# EasyEDA Pro project ProPrj_Lan_Relay_blog_2026-03-05_10-33-51_2026-03-13.epro, schematic Schematic1
Board Name: Board1; Create Date: 2026-03-05; Page Name: P1; Project Name: Lan_Relay_blog_2026-03-05_10-33-51; Schematic Name: Schematic1; Update Date: 2026-03-05; Company: EasyEDA.com; Page Size: A4; Version: V1.0
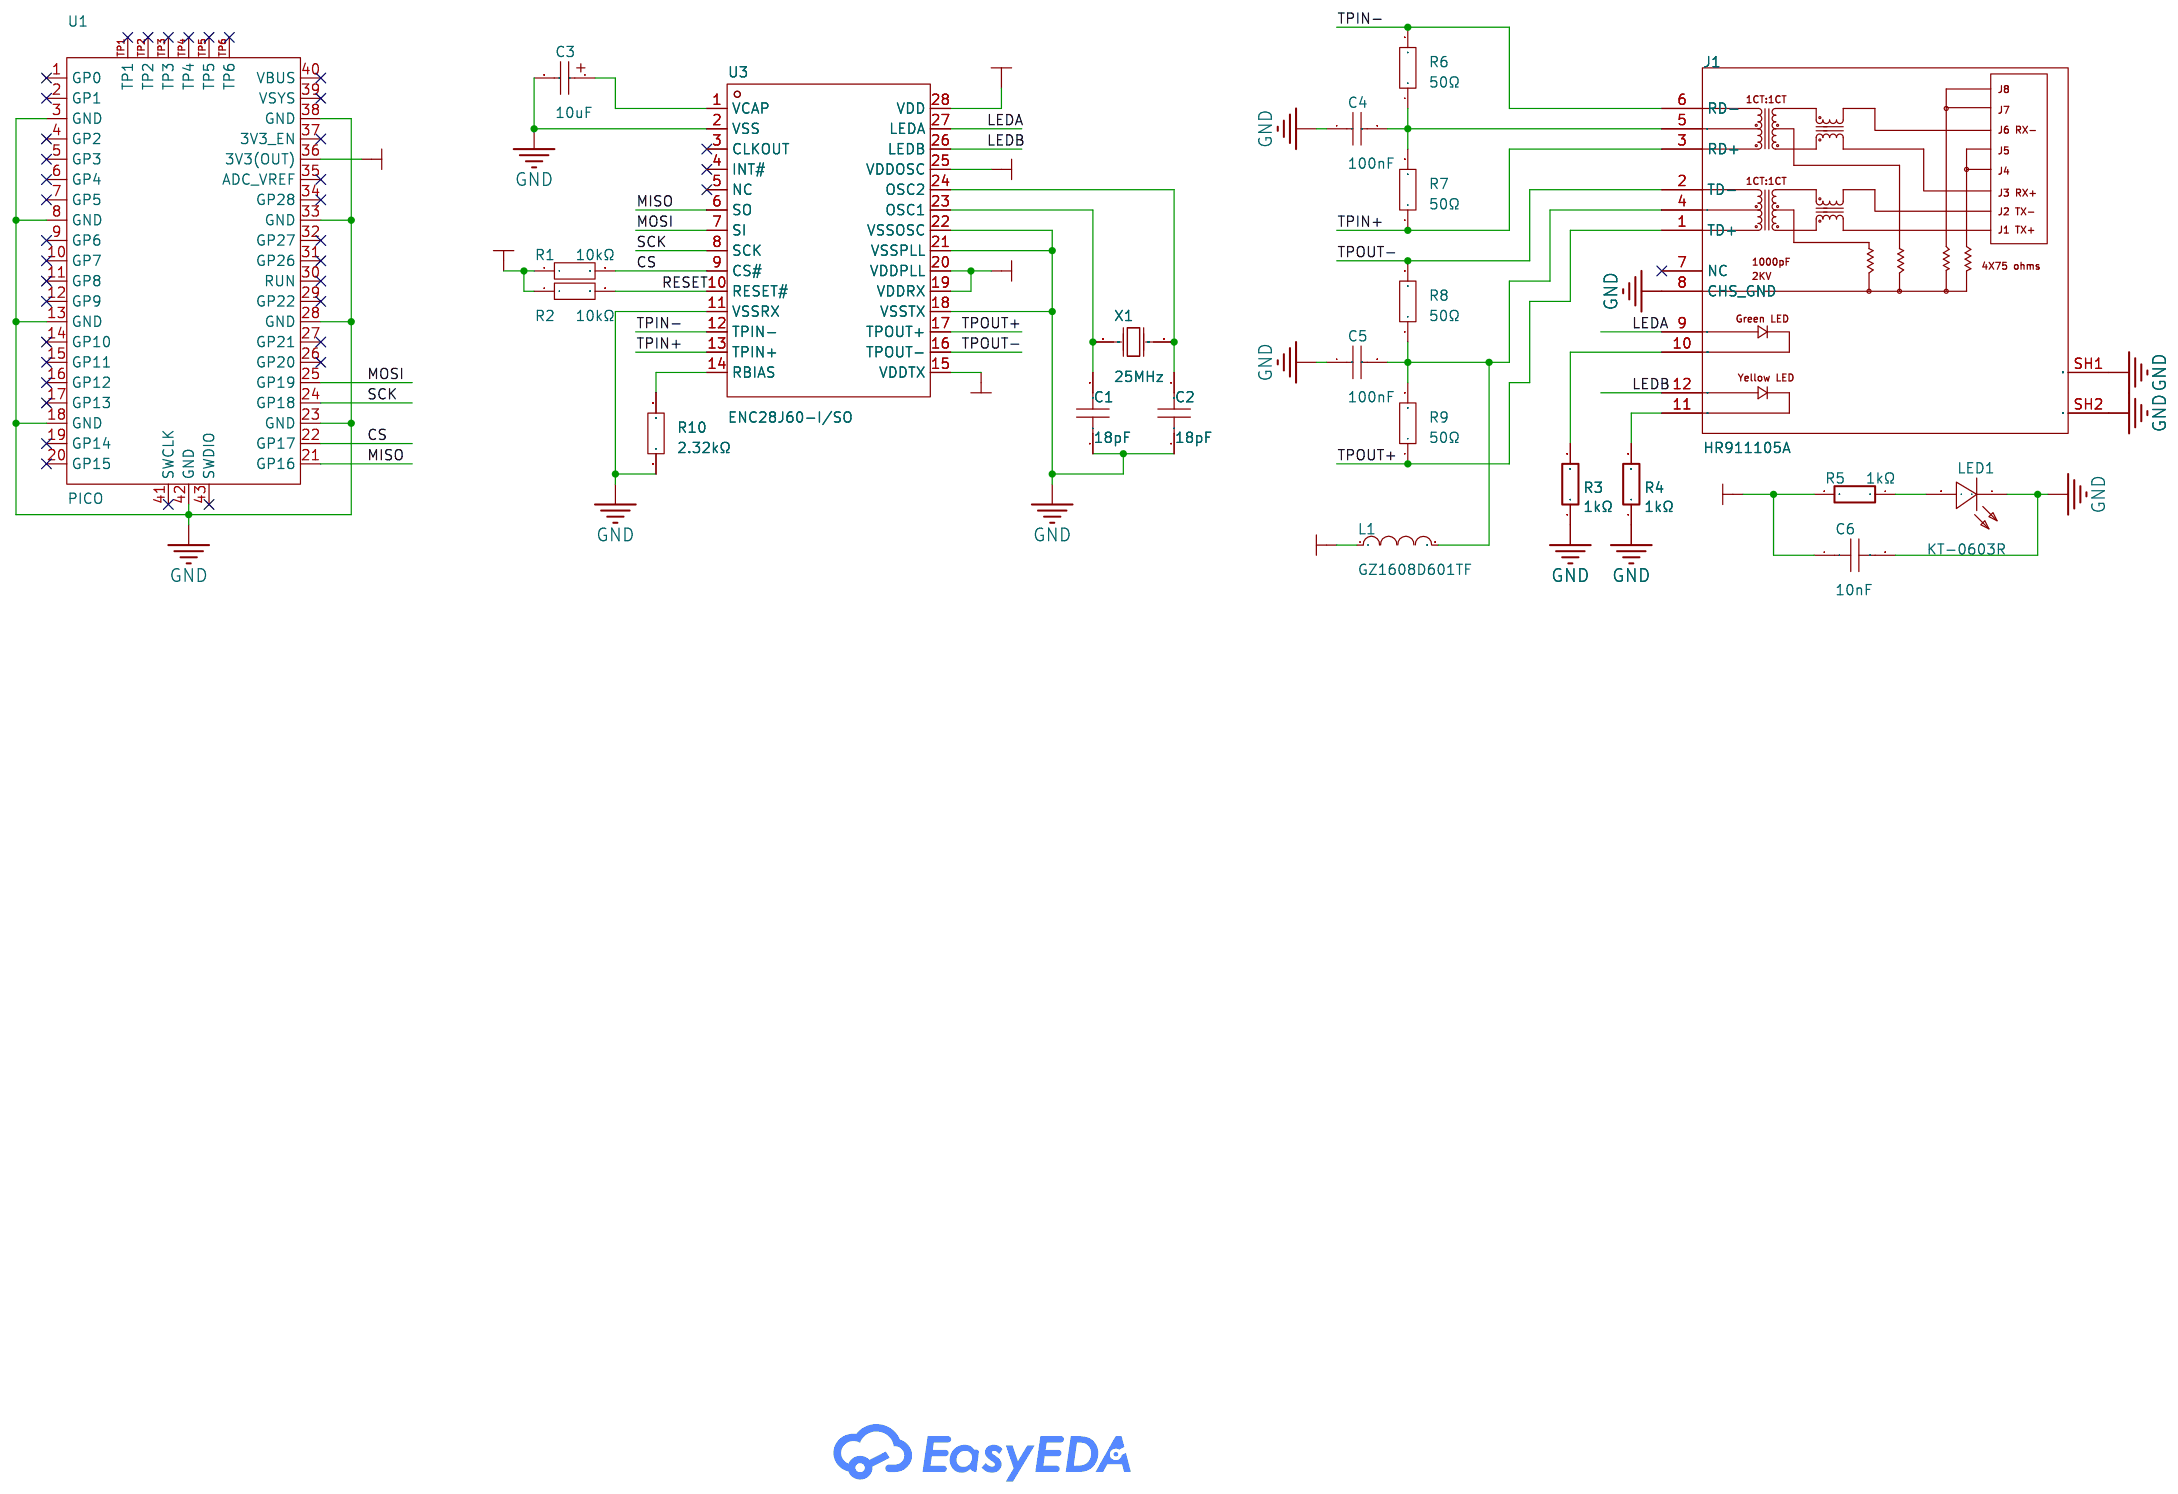
[diagram p0: schematic sheet]

## Parts
C1  18pF  [C0603]
C2  18pF  [C0603]
C3  10uF  [CAP-SMD_L3.2-W1.6-RD-C7171]
C4  100nF  [C0805]
C5  100nF  [C0805]
C6  10nF  [C0603]
J1  HR911105A  [RJ45-TH_HR911105A]
L1  GZ1608D601TF  [L0603]
LED1  KT-0603R  [LED0603-RD]
R1  10kΩ  [R0603]
R2  10kΩ  [R0603]
R3  1kΩ  [R0603]
R4  1kΩ  [R0603]
R5  1kΩ  [R0603]
R6  50Ω  [R0603]
R7  50Ω  [R0603]
R8  50Ω  [R0603]
R9  50Ω  [R0603]
R10  2.32kΩ  [R0603]
U1  PICO  [COMM-SMD_L51.0-W21.0-P2.54_SC0916]
U3  ENC28J60-I/SO  [SOIC-28_L17.9-W7.5-P1.27-LS10.3-BL]
X1  25MHz  [HC-49US_L11.5-W4.5-P4.88]

## Library data of the parts
C1 C2 = CL10C180JB8NNNC: Capacitance:18pF Tolerance:±5% Tolerance:±5% Voltage Rating:50V Temperature Coefficient:C0G; LCSC Part Name: 18pF ±5% 50V; Supplier Part: C1647; Manufacturer: SAMSUNG(三星); Supplier Footprint: 0603; JLCPCB Part Class: Basic Part; Datasheet: https://item.szlcsc.com/datasheet/CL10C180JB8NNNC/1999.html; Supplier: LCSC; Tolerance: ±5%; Voltage Rating: 50V; Temperature Coefficient: C0G
C3 = TAJA106K016RNJ: Capacitance:10uF Tolerance:±10% Tolerance:±10% Voltage Rating:16V Equivalent Series Resistance(ESR):3Ω@100kHz Operating Temperature:-55℃~+125℃ Operating Temperature:-55℃~+125℃; LCSC Part Name: 10uF ±10% 16V; Supplier Part: C7171; Manufacturer: Kyocera AVX; Supplier Footprint: CASE-A-3216-18(mm); JLCPCB Part Class: Basic Part; Supplier: LCSC; Tolerance: ±10%; Voltage Rating: 16V; Equivalent Series Resistance(ESR): 3Ω@100kHz; Operating Temperature: -55℃~+125℃
C4 C5 = CL21B104KCFNNNE: Capacitance:100nF Tolerance:±10% Tolerance:±10% Voltage Rating:100V Temperature Coefficient:X7R; LCSC Part Name: 100nF ±10% 100V; Supplier Part: C28233; Manufacturer: SAMSUNG(三星); Supplier Footprint: 0805; JLCPCB Part Class: Basic Part; Datasheet: https://item.szlcsc.com/datasheet/CL21B104KCFNNNE/28983.html; Supplier: LCSC; Tolerance: ±10%; Voltage Rating: 100V; Temperature Coefficient: X7R
C6 = 0603B103K500NT: Capacitance:10nF Tolerance:±10% Tolerance:±10% Voltage Rating:50V Temperature Coefficient:X7R; LCSC Part Name: 10nF ±10% 50V; Supplier Part: C57112; Manufacturer: FH(风华); Supplier Footprint: 0603; JLCPCB Part Class: Basic Part; Datasheet: https://item.szlcsc.com/datasheet/0603B103K500NT/58143.html; Supplier: LCSC; Tolerance: ±10%; Voltage Rating: 50V; Temperature Coefficient: X7R
J1 = HR911105A_C12074: Connector Type:RJ45 Jack Mounting Type:- Number of Ports:1 LED:With LED Shielding:- Ratings:- PoE:Non-PoE Supplementary Features:Filtered Contact Material:- Contact Plating:- Operating Temperature:- Operating Temperature:-; LCSC Part Name: 带LED; Supplier Part: C12074; Manufacturer: HANRUN(汉仁); Supplier Footprint: 插件; JLCPCB Part Class: Extended Part; Datasheet: https://item.szlcsc.com/datasheet/HR911105A/12651.html; Supplier: LCSC; Connector Type: RJ45 Jack; Number of Ports: 1; LED: With LED; PoE: Non-PoE; Supplementary Features: Filtered
L1 = GZ1608D601TF: Impedance @ Frequency:600Ω@100MHz Tolerance:±25% Tolerance:±25% DC Resistance(DCR):450mΩ Current Rating:200mA Number of Circuits:1 Operating Temperature:-55℃~+125℃ Operating Temperature:-55℃~+125℃; LCSC Part Name: 单路 0603磁珠 阻抗600Ω@100MHz; Supplier Part: C1002; Manufacturer: Sunlord(顺络); Supplier Footprint: 0603; JLCPCB Part Class: Basic Part; Datasheet: https://item.szlcsc.com/datasheet/GZ1608D601TF/1354.html; Supplier: LCSC; Impedance @ Frequency: 600Ω@100MHz; Tolerance: ±25%; DC Resistance(DCR): 450mΩ; Current Rating: 200mA; Number of Circuits: 1; Operating Temperature: -55℃~+125℃
LED1 = KT-0603R: Emitted Color:Red Power Dissipation:- Forward Current:- Dominant Wavelength:- Dominant Wavelength:- Peak Wavelength:- Diode Configuration:- Lens Color:- Color Temperature:- Color Temperature:- Viewing Angle:- Mounting Sytle:- Operating Temperature:-40℃~+8; LCSC Part Name: 0603 红灯 高亮; Supplier Part: C2286; Manufacturer: KENTO; Supplier Footprint: 0603; JLCPCB Part Class: Basic Part; Datasheet: https://atta.szlcsc.com/upload/public/pdf/source/20160616/1466072038404.pdf; Supplier: LCSC; Emitted Color: Red; Operating Temperature: -40℃~+85℃
R1 R2 = 0603WAF1002T5E: Type:Thick Film Resistor Resistance:10kΩ Tolerance:±1% Tolerance:±1% Power(Watts):100mW Voltage-Supply(Max):75V Temperature Coefficient:±100ppm/℃ Temperature Coefficient:±100ppm/℃ Operating Temperature:-55℃~+155℃ Operating Temperature:-55℃~+155℃; LCSC Part Name: 厚膜电阻 10kΩ ±1% 100mW; Supplier Part: C25804; Manufacturer: UNI-ROYAL(厚声); Supplier Footprint: 0603; JLCPCB Part Class: Basic Part; Datasheet: https://item.szlcsc.com/datasheet/0603WAF1002T5E/26547.html; Supplier: LCSC; Type: Thick Film Resistor; Tolerance: ±1%; Power(Watts): 100mW; Voltage-Supply(Max): 75V; Temperature Coefficient: ±100ppm/℃; Operating Temperature: -55℃~+155℃
R3-R5 = 0603WAF1001T5E: Type:Thick Film Resistor Resistance:1kΩ Tolerance:±1% Tolerance:±1% Power(Watts):100mW Voltage-Supply(Max):75V Temperature Coefficient:±100ppm/℃ Temperature Coefficient:±100ppm/℃ Operating Temperature:-55℃~+155℃ Operating Temperature:-55℃~+155℃; LCSC Part Name: 1kΩ ±1% 100mW 厚膜电阻; Supplier Part: C21190; Manufacturer: UNI-ROYAL(厚声); Supplier Footprint: 0603; JLCPCB Part Class: Basic Part; Datasheet: https://item.szlcsc.com/datasheet/0603WAF1001T5E/21904.html; Supplier: LCSC; Type: Thick Film Resistor; Tolerance: ±1%; Power(Watts): 100mW; Voltage-Supply(Max): 75V; Temperature Coefficient: ±100ppm/℃; Operating Temperature: -55℃~+155℃
R6-R9 = CRCW060350R0FKEA: Type:Thick Film Resistors Resistance:50Ω Tolerance:±1% Tolerance:±1% Power(Watts):100mW Temperature Coefficient:±100ppm/℃ Temperature Coefficient:±100ppm/℃ Operating Temperature:-55℃~+155℃ Operating Temperature:-55℃~+155℃; LCSC Part Name: 厚膜电阻 50Ω ±1% 100mW; Supplier Part: C844932; Manufacturer: VISHAY(威世); Supplier Footprint: 0603; JLCPCB Part Class: Extended Part; Datasheet: https://item.szlcsc.com/datasheet/CRCW060350R0FKEA/904506.html; Supplier: LCSC; Type: Thick Film Resistors; Tolerance: ±1%; Power(Watts): 100mW; Temperature Coefficient: ±100ppm/℃; Operating Temperature: -55℃~+155℃
R10 = 0603WAF2321T5E: Type:Thick Film Resistor Resistance:2.32kΩ Tolerance:±1% Tolerance:±1% Power(Watts):100mW Voltage-Supply(Max):75V Temperature Coefficient:±100ppm/℃ Temperature Coefficient:±100ppm/℃ Operating Temperature:-55℃~+155℃ Operating Temperature:-55℃~+155℃; LCSC Part Name: 2.32kΩ ±1% 100mW 厚膜电阻; Supplier Part: C22905; Manufacturer: UNI-ROYAL(厚声); Supplier Footprint: 0603; JLCPCB Part Class: Extended Part; Datasheet: https://item.szlcsc.com/datasheet/0603WAF2321T5E/23632.html; Supplier: LCSC; Type: Thick Film Resistor; Tolerance: ±1%; Power(Watts): 100mW; Voltage-Supply(Max): 75V; Temperature Coefficient: ±100ppm/℃; Operating Temperature: -55℃~+155℃
U1 = PICO: Supplier Part: C7203002; Manufacturer: Raspberry Pi(树莓派); JLCPCB Part Class: Extended Part; Datasheet: https://item.szlcsc.com/datasheet/PICO/8170960.html; Supplier: LCSC
U3 = ENC28J60-I/SO: Number of Channels:1 Interface:SPI Voltage - Supply:3.3V Voltage - Supply:3.3V Current - Supply:160mA Operating Temperature:-40℃~+85℃ Operating Temperature:-40℃~+85℃; Supplier Part: C47351; Manufacturer: MICROCHIP(美国微芯); Supplier Footprint: SOIC-28-300mil; JLCPCB Part Class: Extended Part; Datasheet: https://item.szlcsc.com/datasheet/ENC28J60-I%252FSO/48356.html; Supplier: LCSC; Number of Channels: 1; Interface: SPI; Voltage - Supply: 3.3V; Current - Supply: 160mA; Operating Temperature: -40℃~+85℃
X1 = X49SD25MSD2SC: Type:Through-Hole Crystal Oscillator Frequency:25MHz Normal temperature Frequency Tolerance:±20ppm Normal temperature Frequency Tolerance:±20ppm Load Capacitance:20pF Frequency Stability:±30ppm Frequency Stability:±30ppm Operating Temperature:-20℃~+70℃ Op; LCSC Part Name: HC-49US 25MHZ 2P 49S 20PF ±20PPM -20~70℃ (±30PPM); Supplier Part: C14730; Manufacturer: YXC(扬兴晶振); Supplier Footprint: HC-49S; JLCPCB Part Class: Extended Part; Datasheet: https://item.szlcsc.com/datasheet/X49SD25MSD2SC/15400.html; Supplier: LCSC; Type: Through-Hole Crystal Oscillator; Normal temperature Frequency Tolerance: ±20ppm; Load Capacitance: 20pF; Frequency Stability: ±30ppm; Operating Temperature: -20℃~+70℃

## Nets
+3.3V: C6.1 L1.1 R1.1 R2.1 R5.2 U1.36(3V3(OUT)) U3.15(VDDTX) U3.19(VDDRX) U3.20(VDDPLL) U3.25(VDDOSC) U3.28(VDD)
GND: C1.1 C2.1 C3.2 C4.1 C5.1 C6.2 J1.8(CHS GND) J1.SH1 J1.SH2 LED1.1(K) R3.1 R4.1 R10.1 U1.3(GND) U1.8(GND) U1.13(GND) U1.18(GND) U1.23(GND) U1.28(GND) U1.33(GND) U1.38(GND) U1.42(GND) U3.2(VSS) U3.11(VSSRX) U3.18(VSSTX) U3.21(VSSPLL) U3.22(VSSOSC)
CS: R1.2 U1.22(GP17) U3.9(CS#)
LEDA: J1.9 U3.27(LEDA)
LEDB: J1.12 U3.26(LEDB)
MISO: U1.21(GP16) U3.6(SO)
MOSI: U1.25(GP19) U3.7(SI)
RESET: R2.2 U3.10(RESET#)
SCK: U1.24(GP18) U3.8(SCK)
TPIN+: J1.3(RD+) R7.1 U3.13(TPIN+)
TPIN-: J1.6(RD-) R6.2 U3.12(TPIN-)
TPOUT+: J1.1(TD+) R9.1 U3.17(TPOUT+)
TPOUT-: J1.2(TD-) R8.2 U3.16(TPOUT-)
$1N1237: R10.2 U3.14(RBIAS)
$1N1253: C3.1 U3.1(VCAP)
$1N1258: C5.2 J1.4 L1.2 R8.1 R9.2
$1N1264: C4.2 J1.5 R6.1 R7.2
$1N1268: C1.2 U3.23(OSC1) X1.2(OSC2)
$1N1269: C2.2 U3.24(OSC2) X1.1(OSC1)
$1N1286: J1.10 R3.2
$1N1289: J1.11 R4.2
$1N1292: LED1.2(A) R5.1

Not connected (* = marked no-connect by the designer): J1 7(NC)*; U1 1(GP0)* 2(GP1)* 4(GP2)* 5(GP3)* 6(GP4)* 7(GP5)* 9(GP6)* 10(GP7)* 11(GP8)* 12(GP9)* 14(GP10)* 15(GP11)* 16(GP12)* 17(GP13)* 19(GP14)* 20(GP15)* 26(GP20)* 27(GP21)* 29(GP22)* 30(RUN)* 31(GP26)* 32(GP27)* 34(GP28)* 35(ADC_VREF)* 37(3V3_EN)* 39(VSYS)* 40(VBUS)* 41(SWCLK)* 43(SWDIO)* TP1* TP2* TP3* TP4* TP5* TP6*; U3 3(CLKOUT)* 4(INT#)* 5(NC)*
